# Altium schematic sheet Sheet1.SchDoc
size 431 x 279 mm; SheetNumber: 1; SheetTotal: 1; ENG_APP_DATE: --/--/--; DSN_APP_DATE: --/--/--; CHK_APP_DATE: --/--/--
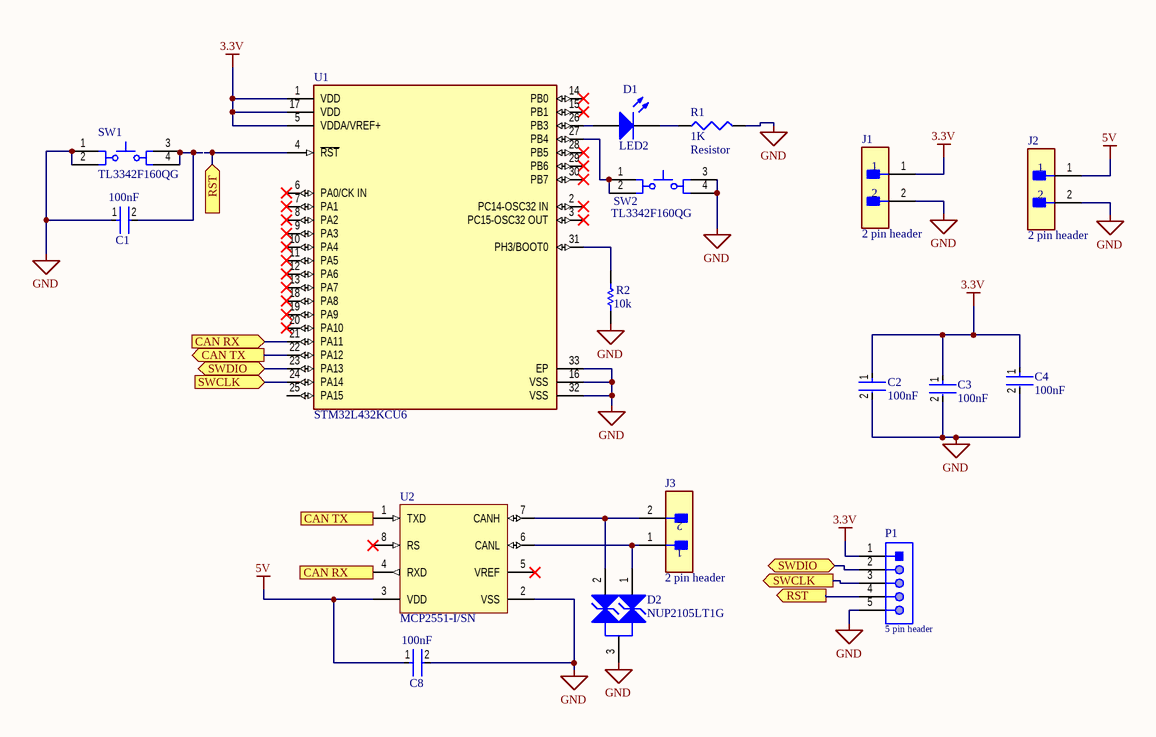
[diagram p0: Sheet1.SchDoc]

## Parts
C1  100nF  [FP-CGA3E-0_3-0_1-MFG]
C2  100nF  [FP-CGA3E-0_3-0_1-MFG]
C3  100nF  [FP-CGA3E-0_3-0_1-MFG]
C4  100nF  [FP-CGA3E-0_3-0_1-MFG]
C8  100nF  [FP-CGA3E-0_3-0_1-MFG]
D1  LED2  [3.2X1.6X1.1]
D2  NUP2105LT1G  [ONSC-SOT-23-3-318-08_V]
J1  2 pin header  [FP-M20-9990246-MFG]
J2  2 pin header  [FP-M20-9990246-MFG]
J3  2 pin header  [FP-M20-9990246-MFG]
P1  5 pin header  [61300511121]
R1  value 1K  [J1-0603]  (hidden comment: Res3)
R2  10k  [RESC1609X50X30ML8T20]
SW1  TL3342F160QG  [ESWI-TL3342F160QG_V]
SW2  TL3342F160QG  [ESWI-TL3342F160QG_V]
U1  STM32L432KCU6  [FP-UFQFPN32-A0B8-MFG]
U2  MCP2551-I/SN  [MCHP-SN8_V]

## Ports
CAN RX (in), CAN RX (out), CAN TX (in), CAN TX (out), RST (in), RST (out), SWCLK (in), SWCLK (out), SWDIO (bidir)

## Nets
3.3V: C2.1 C3.1 C4.1 J1.1 P1.1 U1.1(VDD) U1.5(VDDA/VREF+) U1.17(VDD)
5V: C8.1 J2.1 U2.3(VDD)
GND: C1.1 C2.2 C3.2 C4.2 C8.2 D2.3(K) J1.2 J2.2 P1.5 R1.2 R2.1 SW1.1 SW1.2 SW2.3 SW2.4 U1.16(VSS) U1.32(VSS) U1.33(EP) U2.2(VSS)
CAN RX: U1.21(PA11) U2.4(RXD) ; port CAN RX
CAN TX: U1.22(PA12) U2.1(TXD) ; port CAN TX
RST: P1.4 U1.4(~{RST}) ; port RST
SWCLK: P1.3 U1.24(PA14) ; port SWCLK
SWDIO: P1.2 U1.23(PA13) ; port SWDIO
NetC1_2: C1.2 SW1.3 SW1.4
NetD1_1: D1.1(A) U1.26(PB3)
NetD1_2: D1.2(K) R1.1
NetD2_1: D2.1(K) J3.1 U2.6(CANL)
NetD2_2: D2.2(K) J3.2 U2.7(CANH)
NetR2_2: R2.2 U1.31(PH3/BOOT0)
NetSW2_1: SW2.1 SW2.2 U1.27(PB4)

Not connected (* = marked no-connect by the designer): U1 2(PC14-OSC32_IN)* 3(PC15-OSC32_OUT)* 6(PA0/CK_IN)* 7(PA1)* 8(PA2)* 9(PA3)* 10(PA4)* 11(PA5)* 12(PA6)* 13(PA7)* 14(PB0)* 15(PB1)* 18(PA8)* 19(PA9)* 20(PA10)* 25(PA15) 28(PB5)* 29(PB6)* 30(PB7)*; U2 5(VREF)* 8(RS)*

## Notes on the sheet
- 8
- 7
- 6
- 5
- 4
- 3
- DWG. NO.
- REV.
- SHT.
- 2
- 1
- THIS DOCUMENT AND THE DATA DISCLOSED HEREIN OR HEREWITH IS THE PROPERTY OF ALTIUM LIMITED AND MAY BE FREELY DISTRIBUTED IN WHOLE. NO RIGHTS ARE RESERVED OR EXPRESS OR IMPLIED WARANTEE GIVEN.
- REVISION
- DESCRIPTION
- DATE
- APPROVED
- F
- E
- D
- C
- B
- ENG:
- APPROVALS
- PROJECT
- SUITE 200
- 2175 SALK AVENUE
- CARLSBAD, CA 92008
- A
- DSN:
- CHK:
- REFERENCE DOCUMENTS
- PROJECT REVISION:
- TITLE
- DOCUMENT REVISION:
- DESIGN ITEM:
- USA
- BOM:
- FAB DWG:
- PCB DWG:
- ASSY DWG:
- SCALE:
- SIZE
- CAGE CODE
- FILE NAME
- DWG NO.
- SHEET
- OF
- REV

## Library data of the parts
C1-C4 C8 = CMP-001-00083-2: CGA Series 0603 100 nF 50 V ±10 % Tolerance X7R SMT Multilayer Ceramic Capacitor 100nf
D1 = CMP-062-000002-1: Typical RED, GREEN, YELLOW, AMBER GaAs LED; PackageDescription: SM LED; 2 Flat Leads; Design Item ID: LED2; LatestRevisionNote: Re-released for DXP Platform.; PackageReference: 3.2X1.6X1.1; LatestRevisionDate: 17-Jul-2002; Source: Miscellaneous Devices.SchLib; PackageVersion: Feb-2002; Publisher: Altium Limited; Published: 8-Jun-2000
D2 = CMP-004-00032-1: NUP2105L Series 350 W Dual Line CAN Bus Protector ESD Protection Diode - SOT-23
J1-J3 = CMP-002-00096-1: 2.54mm (0.1") Pitch SIL Vertical PC Tail Pin Header, 6.1mm mating pin height, tin, 2 contacts
P1 = CMP-002-00095-1: THT Vertical Pin Header WR-PHD, Pitch 2.54 mm, Single Row, 5 pins
R1 = CMP-063-000002-1: Resistor; PackageReference: J1-0603; Type: Resistor; Source: Miscellaneous Devices.SchLib; Publisher: Altium Limited; Published: 8-Jun-2000; LatestRevisionNote: IPC-7351 Footprint Added.; Design Item ID: Res3; PackageDescription: Chip Resistor; LatestRevisionDate: 29-May-2009
R2 = CMP-009-00178-3: Res Thick Film 0603 10K Ohm 1% 1/10W ±100ppm/°C Molded SMD Paper T/R
SW1 SW2 = CMP-00005-1: Switch Tactile N.O. SPST Round Button Gull Wing 0.05A 12VDC 100000Cycles 1.57N SMD T/R
U1 = CMP-020-00023-1: MCU 32-bit Ultra Low Power STM32L ARM Cortex-M4 RISC 256kB Flash 32-Pin QFN ECOPACK2 Tray
U2 = CMP-015-00008-1: MCP2551 Series 5V 1 Mb/s Surface Mount High-Speed CAN Transceiver - SOIC-8